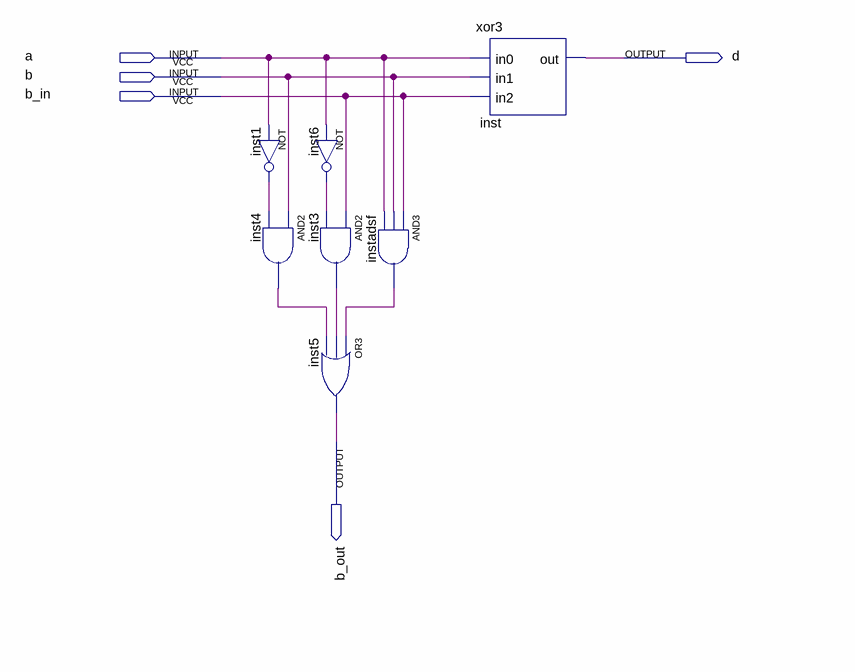
[diagram p0: schematic sheet]
// Quartus schematic full_subtractor.bdf as structural Verilog: 7 symbols, 5 pins
module full_subtractor (
  input  a,
  input  b,
  input  b_in,
  output d,
  output b_out
);

  wire inst1_out, inst3_out, inst4_out, inst6_out, instadsf_out;

  not inst1 (inst1_out, a);
  and inst4 (inst4_out, b, inst1_out);
  not inst6 (inst6_out, a);
  and inst3 (inst3_out, b_in, inst6_out);
  or inst5 (b_out, instadsf_out, inst3_out, inst4_out);
  and instadsf (instadsf_out, b_in, b, a);
  xor3 inst (.in0(a), .in1(b), .in2(b_in), .out(d));
endmodule
